# Altium schematic sheet BQ24259RGER.SchDoc
size A; SheetNumber: 7; SheetTotal: 30
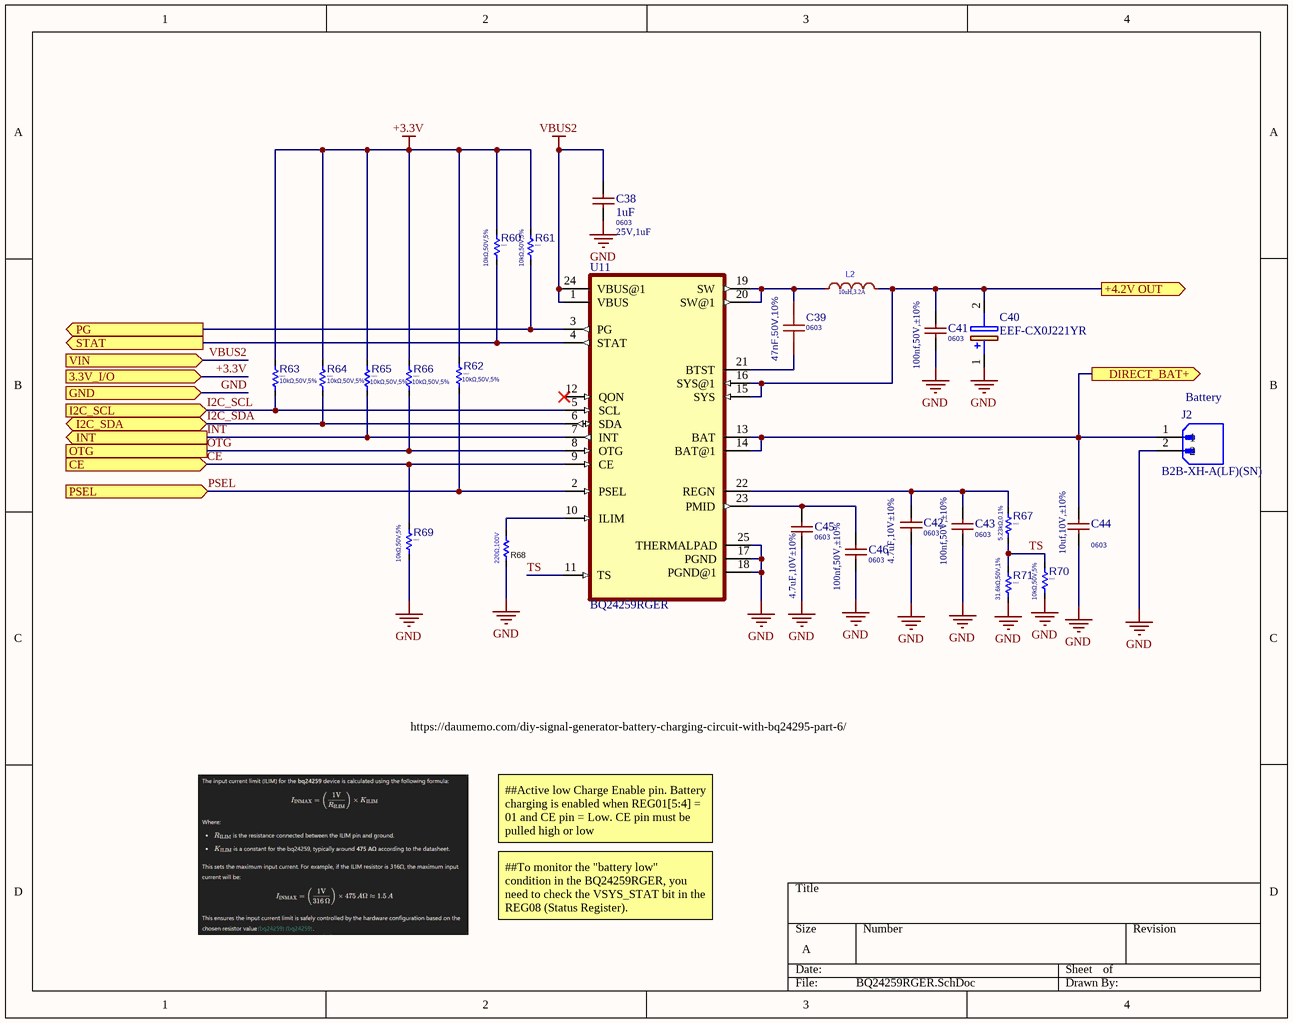
[diagram p0: BQ24259RGER.SchDoc]

## Parts
C38  1uF  value 25V,1uF  Package: 0603  [CAPC1608X90N]
C39  value 47nF,50V,10%  Package: 0603  [C0603]  (hidden comment: 47nF)
C40  EEF-CX0J221YR  [CAPPM7343X200N]
C41  value 100nf,50V,±10%  Package: 0603  [C0603]  (hidden comment: CC0603KRX7R9BB104)
C42  value 4.7uF,10V±10%  Package: 0603  [C0603]  (hidden comment: 4.7uf)
C43  value 100nf,50V,±10%  Package: 0603  [C0603]  (hidden comment: CC0603KRX7R9BB104)
C44  Package: 0603  [C0603]  (hidden comment: 10uf,10V,±10%)
C45  value 4.7uF,10V±10%  Package: 0603  [C0603]  (hidden comment: 4.7uf)
C46  value 100nf,50V,±10%  Package: 0603  [C0603]  (hidden comment: CC0603KRX7R9BB104)
J2  B2B-XH-A(LF)(SN)  [JST_B2B-XH-A(LF)(SN)]
L2  value 10uH,3.2A  [inductor_SMD,5.2x5.4mm]  (hidden comment: 10uH)
R60  value 10kΩ,50V,5%  Package: 0402  [R0402]  (hidden comment: 10kΩ)
R61  value 10kΩ,50V,5%  Package: 0402  [R0402]  (hidden comment: 10kΩ)
R62  value 10kΩ,50V,5%  Package: 0402  [R0402]  (hidden comment: 10kΩ)
R63  value 10kΩ,50V,5%  Package: 0402  [R0402]  (hidden comment: 10kΩ)
R64  value 10kΩ,50V,5%  Package: 0402  [R0402]  (hidden comment: 10kΩ)
R65  value 10kΩ,50V,5%  Package: 0402  [R0402]  (hidden comment: 10kΩ)
R66  value 10kΩ,50V,5%  Package: 0402  [R0402]  (hidden comment: 10kΩ)
R67  value 5.23kΩ,0.1%  Package: 0402  [R0402]  (hidden comment: 5.23kΩ)
R68  value 220Ω,100V  [R0402]  (hidden comment: 220Ω)
R69  value 10kΩ,50V,5%  Package: 0402  [R0402]  (hidden comment: 10kΩ)
R70  value 10kΩ,50V,5%  Package: 0402  [R0402]  (hidden comment: 10kΩ)
R71  value 31.6kΩ,50V,1%  Package: 0402  [R0402]  (hidden comment: 31.6kΩ)
U11  BQ24259RGER  [QFN50P400X400X100-25N]

## Ports
3.3V_I/O (in), +4.2V OUT (out), CE (in), DIRECT_BAT+ (out), GND (in), I2C_SCL (in), I2C_SDA (bidir), INT (out), OTG, PG (out), PSEL (in), STAT (out), VIN (in)

## Nets
+3.3V: R60.2 R61.2 R62.2 R63.2 R64.2 R65.2 R66.2 ; port 3.3V_I/O
GND: C38.1 C40.1(+) C41.1 C42.1 C43.1 C44.1 C45.1 C46.1 J2.2 R68.1 R69.1 R70.1 R71.1 U11.17(PGND) U11.18(PGND@1) U11.25(THERMALPAD) ; port GND
VBUS2: C38.2 U11.1(VBUS) U11.24(VBUS@1) ; port VIN
+4.2V OUT: C40.2(-) C41.2 L2.2 U11.15(SYS) U11.16(SYS@1) ; port +4.2V OUT
CE: R69.2 U11.9(CE) ; port CE
DIRECT_BAT+: C44.2 J2.1 U11.13(BAT) U11.14(BAT@1) ; port DIRECT_BAT+
I2C_SCL: R63.1 U11.5(SCL) ; port I2C_SCL
I2C_SDA: R64.1 U11.6(SDA) ; port I2C_SDA
INT: R65.1 U11.7(INT) ; port INT
OTG: R66.1 U11.8(OTG) ; port OTG
PG: R61.1 U11.3(PG) ; port PG
PSEL: R62.1 U11.2(PSEL) ; port PSEL
STAT: R60.1 U11.4(STAT) ; port STAT
TS: R67.1 R70.2 R71.2 U11.11(TS)
NetC39_1: C39.1 U11.21(BTST)
NetC39_2: C39.2 L2.1 U11.19(SW) U11.20(SW@1)
NetC42_2: C42.2 C43.2 R67.2 U11.22(REGN)
NetC45_2: C45.2 C46.2 U11.23(PMID)
NetR68_2: R68.2 U11.10(ILIM)

Not connected (* = marked no-connect by the designer): U11 12(QON)*

## Notes on the sheet
- (near J2) Battery
- https://daumemo.com/diy-signal-generator-battery-charging-circuit-with-bq24295-part-6/
- ##Active low Charge Enable pin. Battery charging is enabled when REG01[5:4] = 01 and CE pin = Low. CE pin must be pulled high or low
- ##To monitor the "battery low" condition in the BQ24259RGER, you need to check the VSYS_STAT bit in the REG08 (Status Register).

## Library data of the parts
C38 = 0603B105K250NT: 25V 1uF X7R ±10% 0603 Multilayer Ceramic Capacitors MLCC - SMD/SMT ROHS; Manufacturer: FH (Guangdong Fenghua Advanced Tech); LCSC: C59302; Datasheet: https://datasheet.lcsc.com/lcsc/2304140030_FH--Guangdong-Fenghua-Advanced-Tech-0603B105K250NT_C59302.pdf; MPN: 0603B105K250NT
C39 = CL10B473KB8NNNC: 50V 47nF X7R ±10% 0603 Multilayer Ceramic Capacitors MLCC - SMD/SMT ROHS; Manufacturer: SAMSUNG; Type: *; MPN: CL10B473KB8NNNC; Max Operating Temp: +85; Min Operating Temp: -55; Datasheet: https://www.lcsc.com/datasheet/lcsc_datasheet_2304140030_Samsung-Electro-Mechanics-CL10B473KB8NNNC_C1622.pdf; LCSC: C1622
C40 = EEF-CX0J221YR: Capacitor Polarised; Manufacturer_Name: Panasonic; Datasheet Link: https://datasheet.lcsc.com/szlcsc/PANASONIC-EEFCX0J221YR_C141444.pdf; Height: 2mm; Manufacturer_Part_Number: EEF-CX0J221YR; Mouser Part Number: N/A; Mouser Price/Stock: https://www.mouser.com/Search/Refine.aspx?Keyword=N%2FA
C41 C43 C46 = CC0603KRX7R9BB104: 50V 100nF X7R ±10% 0603 Multilayer Ceramic Capacitors MLCC - SMD/SMT ROHS; MPN: 603-CC603KRX7R9BB104; Manufacturer: KEMET; Max Operating Temp: 35 °C; Min Operating Temp: 15 °C; Datasheet: http://componentsearchengine.com/Datasheets/3/CC0603KRX7R9BB104.pdf; LCSC: C14663
C42 C45 = 0603B475K100NT: 10V 4.7uF X7R ±10% 0603 Multilayer Ceramic Capacitors MLCC - SMD/SMT ROHS; MPN: CL10A475KQ8NNNC; Manufacturer: Samsung Electro-Mechanics; Datasheet: https://lcsc.componentsearchengine.com/Datasheets/2/CL10A475KQ8NNNC.pdf
C44 = GRM188Z71A106KA73D: 10V 10uF X7R ±10% 0603 Multilayer Ceramic Capacitors MLCC - SMD/SMT ROHS; MPN: 603-CC603KRX7R9BB104; Manufacturer: KEMET; Max Operating Temp: 125 ℃; Min Operating Temp: -55 ℃; Datasheet: http://componentsearchengine.com/Datasheets/3/CC0603KRX7R9BB104.pdf; LCSC: C2959727; Value: 10uf,10V,±10%
J2 = B2B-XH-A(LF)(SN): Connector Header Through Hole 2 position 0.098 (2.50mm); Manufacturer: JST Sales America Inc.; Value: *; Package: None; MPN: B2B-XH-A(LF)(SN); Datasheet: https://datasheet.lcsc.com/lcsc/2304140030_JST-B2B-XH-A-LF-SN_C158012.pdf; LCSC: C158012
L2 = FXL0530-100-M: 3.2A 10uH Integrated molded inductor ±20% 3.5A SMD,5.2x5.4mm Power Inductors ROHS; Manufacturer: cjiang; LCSC: C177248; MPN: FXL0530-100-M; Package: SMD,5.2x5.4mm; Datasheet: https://atta.szlcsc.com/upload/public/pdf/source/20240426/3189EA8206330E2108542F9E34E540E7.pdf
R60-R66 R69 R70 = RC0402JR-0710KL: 62.5mW Thick Film Resistors 50V ±100ppm/℃ ±5% 10kΩ 0402 Chip Resistor - Surface Mount ROHS; Manufacturer: YAGEO; MPN: RC0402JR-0710KL; Max Operating Temp: +155; Min Operating Temp: -55; Datasheet: https://datasheet.lcsc.com/lcsc/1810241334_YAGEO-RC0402JR-0710KL_C60489.pdf; LCSC: C60489
R67 = RT0402BRD075K23L: 63mW Thin Film Resistor ±25ppm/℃ ±0.1% 5.23kΩ 0402 Chip Resistor - Surface Mount ROHS; Manufacturer: YAGEO; Max Operating Temp: +155; Type: *; Datasheet: https://www.lcsc.com/datasheet/lcsc_datasheet_2311211102_YAGEO-RT0402BRD075K23L_C852857.pdf; MPN: RT0402BRD075K23L; Min Operating Temp: -55; LCSC: C852857
R68 = ERJ2RKF2200X: 100mW Thick Film Resistors 100V ±100ppm/℃ ±1% 220Ω 0402 Chip Resistor - Surface Mount ROHS; Manufacturer: PANASONIC; CSC: C413071; MPN: ERJ2RKF2200X; Package: 0402; Datasheet: https://atta.szlcsc.com/upload/public/pdf/source/20190820/C413071_63A430A85C947944E14EACAA56F7187B.pdf; Operating Temperature Range: -55℃~+155℃
R71 = RC0402FR-0731K6L: 62.5mW Thick Film Resistors 50V ±100ppm/℃ ±1% 31.6kΩ 0402 Chip Resistor - Surface Mount ROHS; Manufacturer: YAGEO; Type: *; MPN: RC0402FR-0731K6L; Max Operating Temp: +155; Min Operating Temp: -55
U11 = BQ24259RGER: I2C controlled 2A single cell USB NVDC-1 charger with adjustable voltageUSB OTG; MF: Texas Instruments; Value: *; SnapEDA_Link: https://www.snapeda.com/parts/BQ24259RGER/Texas+Instruments/view-part/?ref=snap; MP: BQ24259RGER; Package: VQFN-24 Texas Instruments; Check_prices: https://www.snapeda.com/parts/BQ24259RGER/Texas+Instruments/view-part/?ref=eda; Digi-Key_Part_Number: 296-43322-2-ND; Purchase-URL: https://pricing.snapeda.com/search/part/BQ24259RGER/?ref=eda